# EAGLE schematic Eurorack_Gate_In (EAGLE 9.5.2)
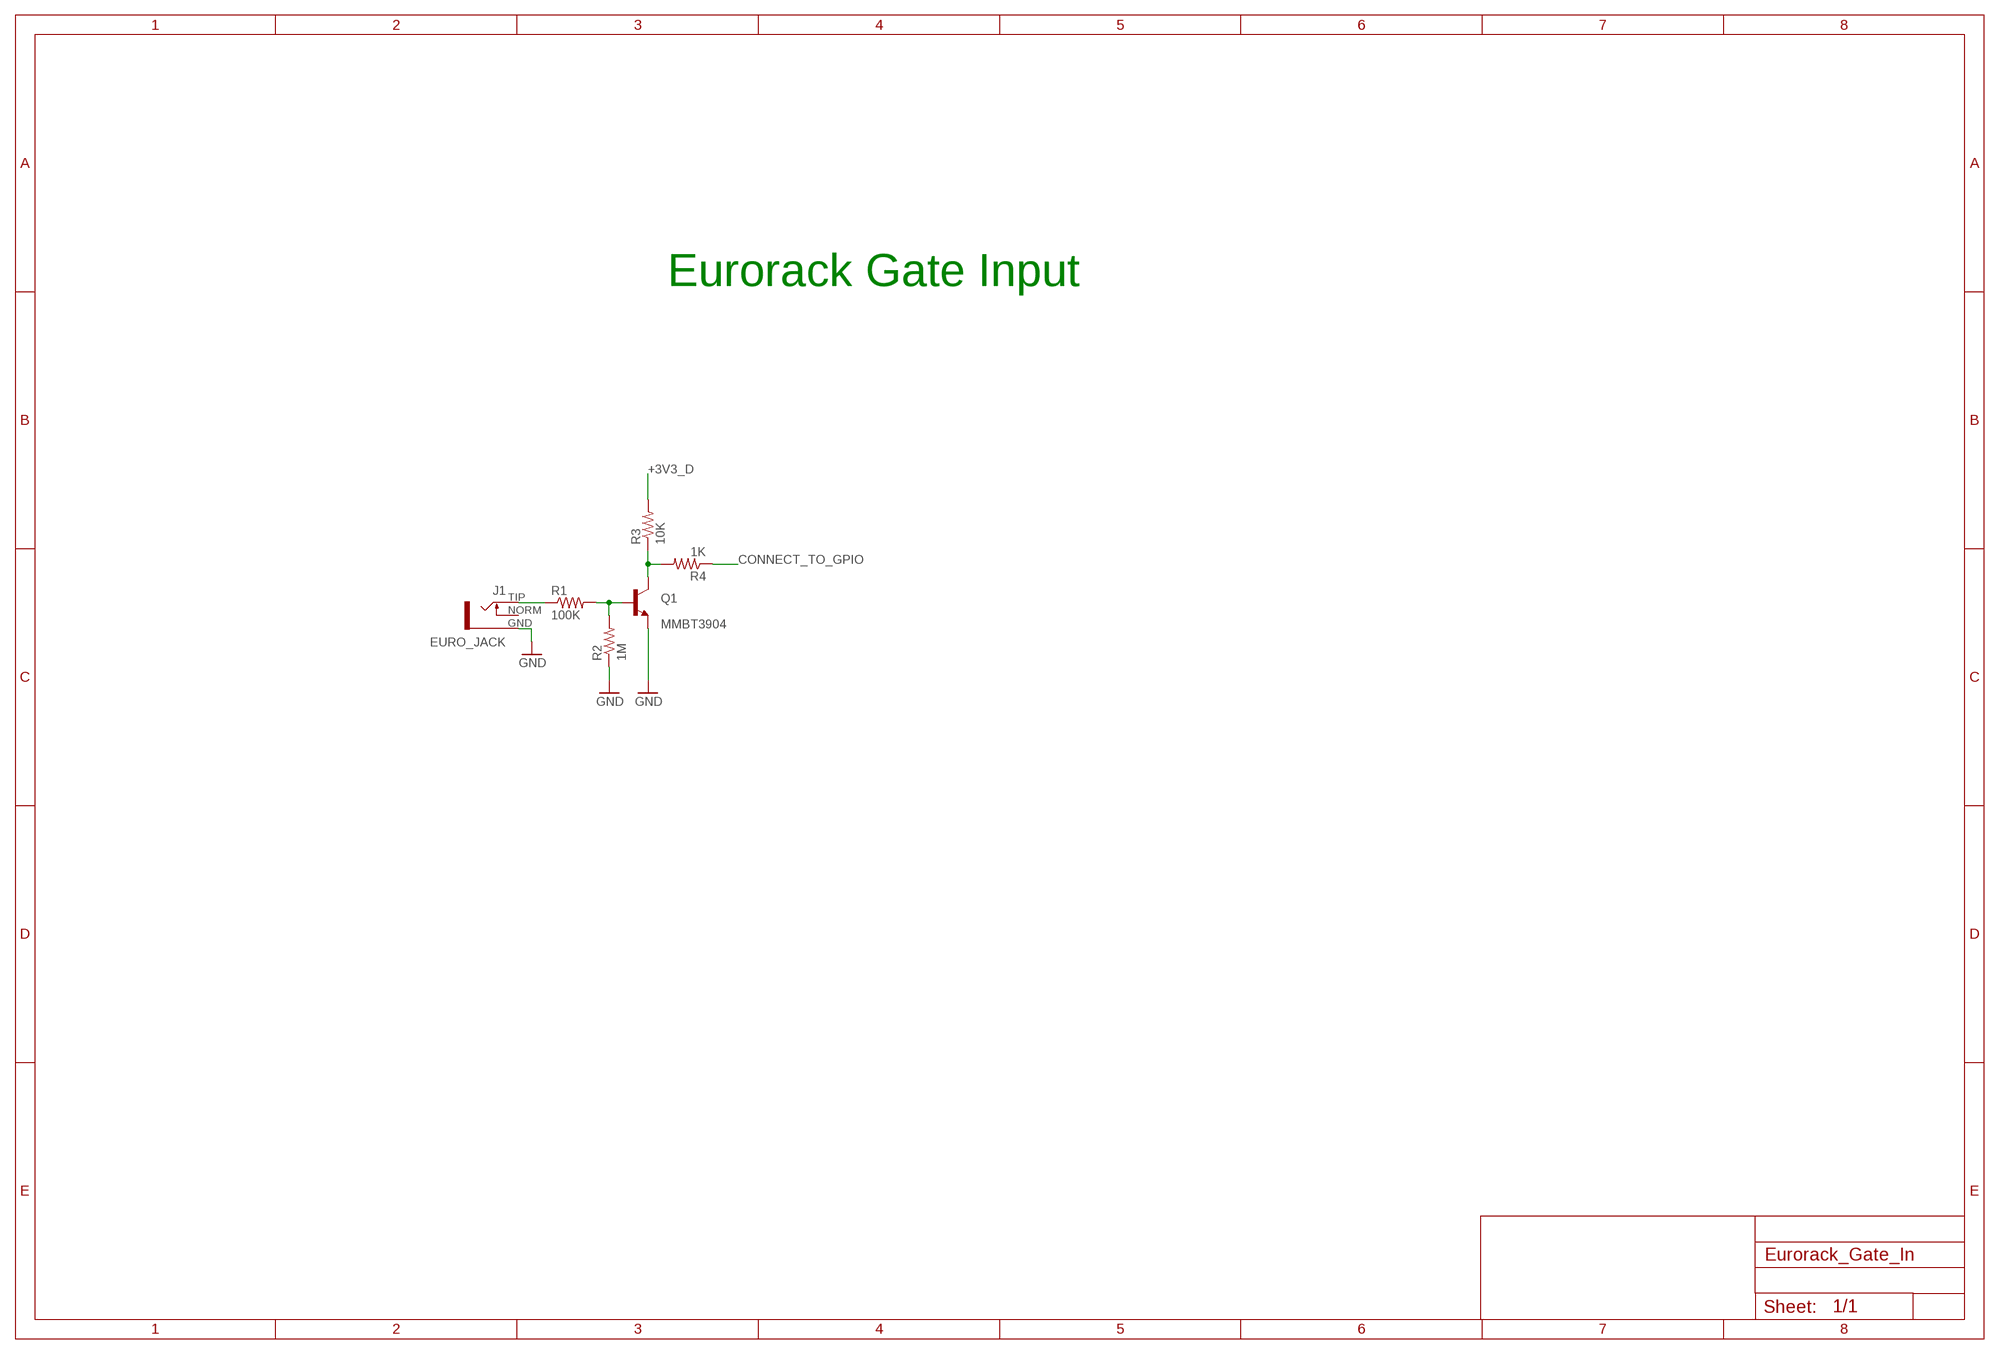
[diagram p0: schematic, sheet 1]

## Parts
J1  EURO_JACK  [S_JACK]
Q1  MMBT3904  NPNSOT23-BEC  [SOT23-BEC]
R1  100K  R-US_R0603  [R0603]
R2  1M  R-US_R0603  [R0603]
R3  10K  R-US_R0603  [R0603]
R4  1K  R-US_R0603  [R0603]

## Nets
+3V3_D: R3.2
CONNECT_TO_GPIO: R4.1
GND: J1.GND Q1.E R2.1
N$23: Q1.C R3.1 R4.2
N$32: Q1.B R1.2 R2.2
SPI1_MOSI_IN: J1.TIP R1.1
Unconnected: J1.NORM

## Notes on the sheet
- Eurorack Gate Input

## Library data of the parts
J1 = Electrosmith-Interface:EURO_JACK
Q1 = Electrosmith-Semiconductors:NPN: NPN Transistror BF959 corrected 2008.03.06
R1-R4 = Electrosmith-Passives:R-US_: RESISTOR, American symbol; PACKAGE: R0603

## Net classes
0 default: width 0.203 mm